# Altium schematic sheet 4_MotorDrive.SchDoc
size A
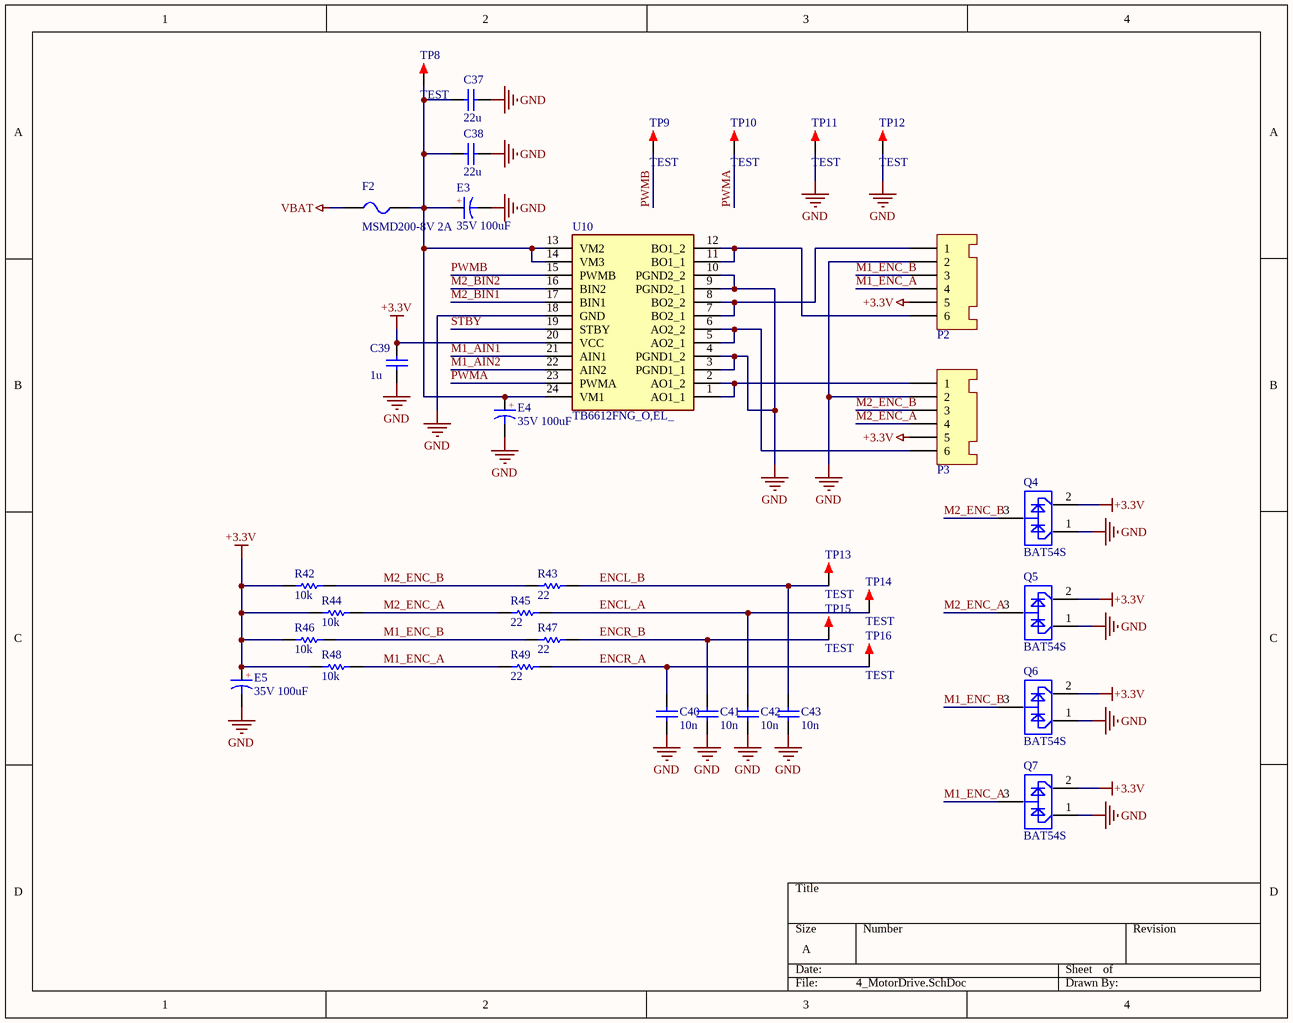
[diagram p0: 4_MotorDrive.SchDoc]

## Parts
C37  22u  [C1812_L]
C38  22u  [C1812_L]
C39  1u  [CAP_0603_SMD]
C40  10n  [CAP_0603_SMD]
C41  10n  [CAP_0603_SMD]
C42  10n  [CAP_0603_SMD]
C43  10n  [CAP_0603_SMD]
E3  35V 100uF  [CE D(6.3*7.7)]
E4  35V 100uF  [CE D(6.3*7.7)]
E5  35V 100uF  [CE D(6.3*7.7)]
F2  MSMD200-8V 2A  [FU 1812]
P2  HDR-1X6  [XH2.54-WS-6P]  (value not drawn)
P3  HDR-1X6  [XH2.54-WS-6P]  (value not drawn)
Q4  BAT54S  [TR_SOT-23]
Q5  BAT54S  [TR_SOT-23]
Q6  BAT54S  [TR_SOT-23]
Q7  BAT54S  [TR_SOT-23]
R42  10k  [RES_0603_SMD]
R43  22  [RES_0603_SMD]
R44  10k  [RES_0603_SMD]
R45  22  [RES_0603_SMD]
R46  10k  [RES_0603_SMD]
R47  22  [RES_0603_SMD]
R48  10k  [RES_0603_SMD]
R49  22  [RES_0603_SMD]
TP8  TEST  [TEST 1.2]
TP9  TEST  [TEST 1.2]
TP10  TEST  [TEST 1.2]
TP11  TEST  [TEST 1.2]
TP12  TEST  [TEST 1.2]
TP13  TEST  [TEST 1.2]
TP14  TEST  [TEST 1.2]
TP15  TEST  [TEST 1.2]
TP16  TEST  [TEST 1.2]
U10  TB6612FNG_O,EL_  [SOP65P760X160-24N]

## Nets
+3.3V: C39.1 E5.1 P2.5 P3.5 Q4.2 Q5.2 Q6.2 Q7.2 R42.2 R44.2 R46.2 R48.2 U10.20(VCC)
GND: C37.1 C38.1 C39.2 C40.2 C41.2 C42.2 C43.2 E3.2 E4.2 E5.2 P2.2 P3.2 Q4.1 Q5.1 Q6.1 Q7.1 TP11.1 TP12.1 U10.3(PGND1_1) U10.4(PGND1_2) U10.9(PGND2_1) U10.10(PGND2_2) U10.18(GND)
VBAT: F2.1
ENCL_A: C42.1 R45.1 TP14.1
ENCL_B: C43.1 R43.1 TP13.1
ENCR_A: C40.1 R49.1 TP16.1
ENCR_B: C41.1 R47.1 TP15.1
M1_AIN1: U10.21(AIN1)
M1_AIN2: U10.22(AIN2)
M1_ENC_A: P2.4 Q7.3 R48.1 R49.2
M1_ENC_B: P2.3 Q6.3 R46.1 R47.2
M2_BIN1: U10.17(BIN1)
M2_BIN2: U10.16(BIN2)
M2_ENC_A: P3.4 Q5.3 R44.1 R45.2
M2_ENC_B: P3.3 Q4.3 R42.1 R43.2
PWMA: TP10.1 U10.23(PWMA)
PWMB: TP9.1 U10.15(PWMB)
STBY: U10.19(STBY)
NetC37_2: C37.2 C38.2 E3.1 E4.1 F2.2 TP8.1 U10.13(VM2) U10.14(VM3) U10.24(VM1)
NetP2_1: P2.1 U10.7(BO2_1) U10.8(BO2_2)
NetP2_6: P2.6 U10.11(BO1_1) U10.12(BO1_2)
NetP3_1: P3.1 U10.1(AO1_1) U10.2(AO1_2)
NetP3_6: P3.6 U10.5(AO2_1) U10.6(AO2_2)

## Notes on the sheet
- (in symbol CE_SMD) +

## Library data of the parts
C37 C38 = C: 贴片电容; BOM名称: 无极性贴片电容; 联系卖家，免费查找封装: 唯一出售店铺网址https://shop463601444.taobao.com; 封装库来自淘宝卖家ID：黄晶宝石: 其他店铺购入均为盗版假冒封装库，请立即申请退款
C39-C43 = CAP_0603_SMD: Capacitor, 0603, SMD; Published: 8-Jun-2000; LatestRevisionDate: 17-Jul-2002; LatestRevisionNote: Re-released for DXP Platform.; PackageReference: RAD-0.3; Publisher: Altium Limited
E3-E5 = CE_SMD: 贴片电解电容; 联系卖家，免费查找封装: 唯一出售店铺网址https://shop463601444.taobao.com; 封装库来自淘宝卖家ID：黄晶宝石: 其他店铺购入均为盗版假冒封装库，请立即申请退款; BOM名称: 贴片电解电容
F2 = FU: 贴片保险丝; 联系卖家，免费查找封装: 唯一出售店铺网址https://shop463601444.taobao.com; BOM名称: 贴片保险丝
P2 P3 = Header 6: 6P接插件; 封装库来自淘宝卖家 ID：黄晶宝石: 其他店铺购入均为盗版假冒封装库; 联系卖家，免费查找封装: 唯一出售店铺网址https://shop463601444.taobao.com; BOM名称: 6P接插件
Q4-Q7 = BAT54S: Dual Schottky Diodes, SOT23
R42-R49 = RES_0603_SMD: Resistor, 0603, SMD; Published: 8-Jun-2000; LatestRevisionDate: 17-Jul-2002; LatestRevisionNote: Re-released for DXP Platform.; PackageReference: AXIAL-0.3; Publisher: Altium Limited; Value: Value
TP8-TP16 = TEST: 测试点; 联系卖家，免费查找封装: 唯一出售店铺网址https://shop463601444.taobao.com; BOM名称: 测试点
U10 = TB6612FNG_O,EL_: Integrated Circuit; Manufacturer_Name: Toshiba; Manufacturer_Part_Number: TB6612FNG(O,EL); Datasheet Link: https://th.mouser.com/datasheet/2/408/TB6612FNG_datasheet_en_20141001-708260.pdf; Height: 1.6mm; Arrow Part Number: TB6612FNG(O,EL); Mouser Part Number: 757-TB6612FNG(O,EL); Mouser Price/Stock: https://www.mouser.co.uk/ProductDetail/Toshiba/TB6612FNGOEL?qs=%2FbfygUuxYr5ys7QLPOzyng%3D%3D